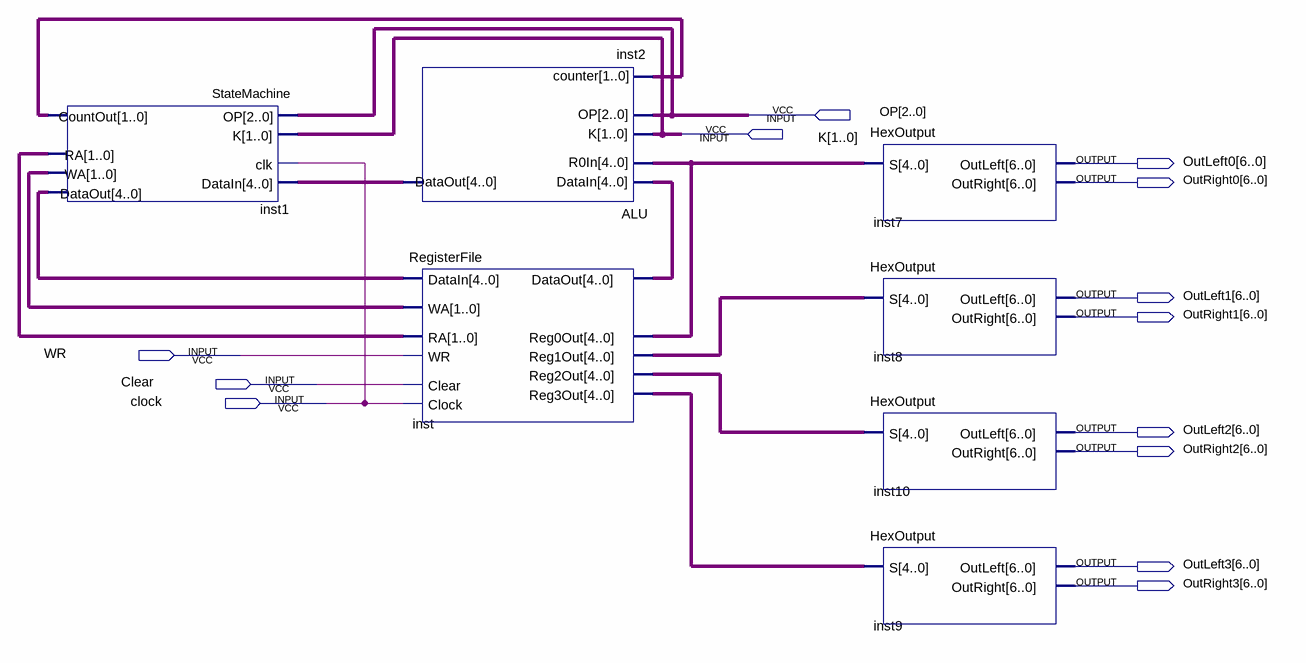
[diagram p0: schematic sheet]
// Quartus schematic Masheen.bdf as structural Verilog: 7 symbols, 13 pins
module Masheen (
  input  [2:0] OP,
  input  [1:0] K,
  input  WR,
  input  Clear,
  input  clock,
  output [6:0] OutLeft0,
  output [6:0] OutRight0,
  output [6:0] OutLeft1,
  output [6:0] OutRight1,
  output [6:0] OutLeft2,
  output [6:0] OutRight2,
  output [6:0] OutLeft3,
  output [6:0] OutRight3
);

  wire [1:0] inst1_countout, inst1_ra, inst1_wa;
  wire [4:0] inst1_dataout, inst2_dataout, inst_dataout, inst_reg0out, inst_reg1out, inst_reg2out,
       inst_reg3out;

  StateMachine inst1 (
    .DataIn(inst2_dataout), .OP(OP), .K(K), .clk(clock), .DataOut(inst1_dataout), .CountOut(inst1_countout),
    .RA(inst1_ra), .WA(inst1_wa));
  ALU inst2 (
    .DataIn(inst_dataout), .R0In(inst_reg0out), .OP(OP), .counter(inst1_countout), .K(K),
    .DataOut(inst2_dataout));
  RegisterFile inst (
    .DataIn(inst1_dataout), .WA(inst1_wa), .WR(WR), .RA(inst1_ra), .Clear(Clear), .Clock(clock),
    .Reg0Out(inst_reg0out), .Reg1Out(inst_reg1out), .DataOut(inst_dataout), .Reg2Out(inst_reg2out),
    .Reg3Out(inst_reg3out));
  HexOutput inst7 (.S(inst_reg0out), .OutLeft(OutLeft0), .OutRight(OutRight0));
  HexOutput inst8 (.S(inst_reg1out), .OutLeft(OutLeft1), .OutRight(OutRight1));
  HexOutput inst10 (.S(inst_reg2out), .OutLeft(OutLeft2), .OutRight(OutRight2));
  HexOutput inst9 (.S(inst_reg3out), .OutLeft(OutLeft3), .OutRight(OutRight3));
endmodule
